# Altium project N-GLCD.PrjPcb
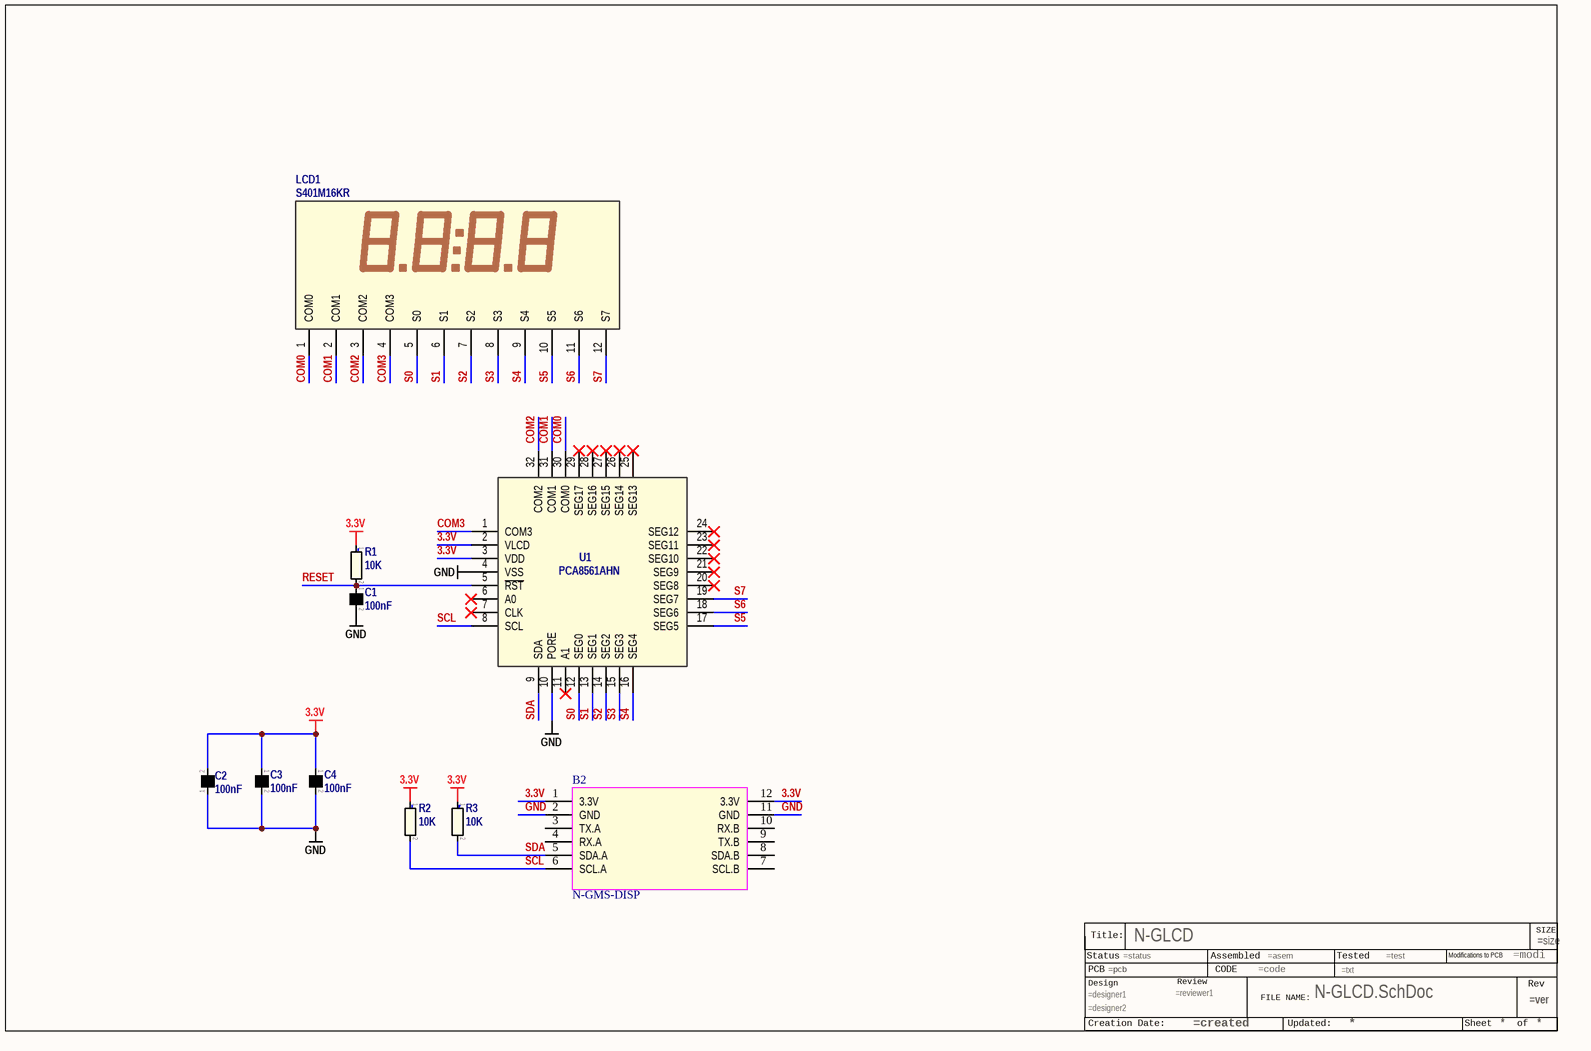
[diagram p0: N-GLCD.SchDoc]
OrderQty: 10; prj: N-GLCD
1 sheet, 11 parts. Net scope: global (net labels, ports and power ports of the same name join across sheets).
Board file: N-GLCD.PcbDoc

## Sheet N-GLCD.SchDoc
size A4

### Parts
?*??  FILE_NAME: N-GLCD.SchDoc  pr: N-GLCD  (hidden comment: TITLEBLOCK3)  (graphical)
B2  N-GMS-DISP  [N-GMS-DISP]
C1  100nF  [0603_cap]
C2  100nF  [0603_cap]
C3  100nF  [0603_cap]
C4  100nF  [0603_cap]
LCD1  S401M16KR  [LCD-S401M16KR]
R1  10K  [0603_res]
R2  10K  [0603_res]
R3  10K  [0603_res]
U1  PCA8561AHN  [QFN32-HVQFN32_0.5mm_LONG]

### Nets
3.3V: B2.1(3.3V) B2.12(3.3V) C2.2 C3.1 C4.1 R1.1 R2.1 R3.1 U1.2(VLCD) U1.3(VDD)
GND: B2.2(GND) B2.11(GND) C1.2 C2.1 C3.2 C4.2 U1.4(VSS) U1.10(PORE)
COM0: LCD1.1(COM0) U1.30(COM0)
COM1: LCD1.2(COM1) U1.31(COM1)
COM2: LCD1.3(COM2) U1.32(COM2)
COM3: LCD1.4(COM3) U1.1(COM3)
RESET: C1.1 R1.2 U1.5(~{RST})
S0: LCD1.5(S0) U1.12(SEG0)
S1: LCD1.6(S1) U1.13(SEG1)
S2: LCD1.7(S2) U1.14(SEG2)
S3: LCD1.8(S3) U1.15(SEG3)
S4: LCD1.9(S4) U1.16(SEG4)
S5: LCD1.10(S5) U1.17(SEG5)
S6: LCD1.11(S6) U1.18(SEG6)
S7: LCD1.12(S7) U1.19(SEG7)
SCL: B2.6(SCL.A) R2.2 U1.8(SCL)
SDA: B2.5(SDA.A) R3.2 U1.9(SDA)

Not connected (* = marked no-connect by the designer): ?*?? ?1; B2 3(TX.A) 4(RX.A) 7(SCL.B) 8(SDA.B) 9(TX.B) 10(RX.B); U1 6(A0)* 7(CLK)* 11(A1)* 20(SEG8)* 21(SEG9)* 22(SEG10)* 23(SEG11)* 24(SEG12)* 25(SEG13)* 26(SEG14)* 27(SEG15)* 28(SEG16)* 29(SEG17)*

### Notes on the sheet
- (in symbol TITLEBLOCK3) SIZE; Title:; Status; Assembled; Tested; Modifications to PCB; PCB; CODE; Design; Review; Rev; FILE NAME:; Creation Date:; Updated:; Sheet; of

### Library data of the parts
C1-C4 = C: CAPACITOR; S.Description: Multilayer Ceramic Capacitors MLCC - SMD/SMT 0.1uF 50volts 10% X7R AUTO; S.Footprint: 0603 (1608 metric); Supplier 1: Mouser; Supplier Part Number 1: 80-C0603C104K5RAUTO
LCD1 = LCD-S401M16KR: S.Description: LCD Numeric Display Modules 4 Digit 0.17" 7 Seg Reflective; Supplier 1: Mouser; Supplier Part Number 1: 696-LCD-S401M16KR
R1-R3 = R: RESISTOR; S.Description: Thick Film Resistors - SMD 1/10watt 10Kohms 1%; S.Footprint: 0603 (1608 metric); Supplier 1: Mouser; Supplier Part Number 1: 71-CRCW0603-10K-E3
U1 = PCA8561AHN: S.Description: LCD Drivers Automotive 18 X 4 LCD segment driver; Supplier 1: Mouser; Supplier Part Number 1: 771-PCA8561AHN/AY
?*?? = TITLEBLOCK3: size: =size; CREATION DATE: =created; UPDATED: *; PAGE NUMPER: *; PAGE COUNT: *; VERSION: =ver; ASSEMBLY: =asem; MODIFICATIONS TO OPERATE: =modi; TESTED: =test; PCB: =pcb; STATUS: =status; CODE: =code; TEXT: =txt; designer1: =designer1; designer2: =designer2; reviewer1: =reviewer1